# Altium project IMU sheild.PrjPcb
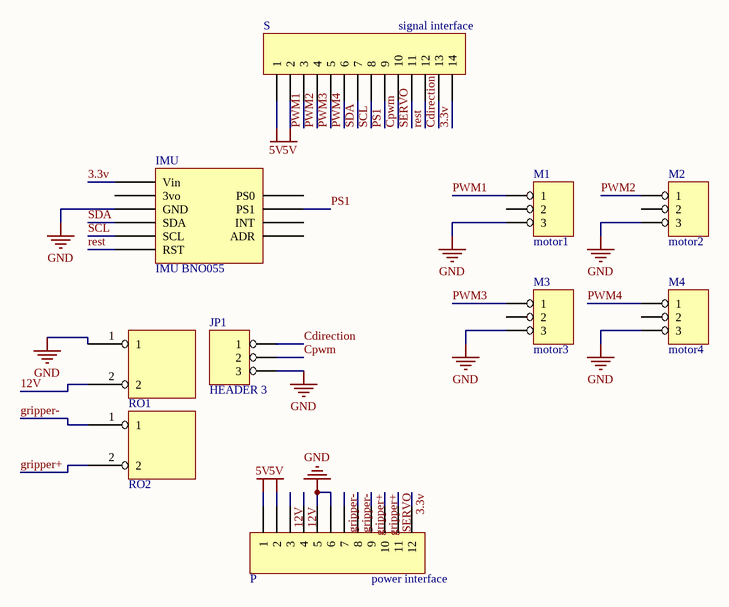
[diagram p0: IMU sheild.SchDoc]
1 sheet, 10 parts. Net scope: global (net labels, ports and power ports of the same name join across sheets).
Board file: IMU sheild.PcbDoc

## Sheet IMU sheild.SchDoc
size OrCAD A

### Parts
IMU  IMU BNO055  [bno055]
JP1  HEADER 3  [SIP3]
M1  motor1  [SIP3]
M2  motor2  [SIP3]
M3  motor3  [SIP3]
M4  motor4  [SIP3]
P  power interface  [HDR1X12]
RO1  Rossetta  [Rossetta 2-pin]  (value not drawn)
RO2  Rossetta  [Rossetta 2-pin]  (value not drawn)
S  signal interface  [HDR1X14]

### Nets
5V: P.1 P.2 S.1 S.2
GND: IMU.GND JP1.3 M1.3 M2.3 M3.3 M4.3 P.5 P.6 RO1.1
3.3v: IMU.Vin P.12 S.14
12V: P.3 P.4 RO1.2
Cdirection: JP1.1 S.13
Cpwm: JP1.2 S.10
gripper+: P.9 P.10 RO2.2
gripper-: P.7 P.8 RO2.1
PS1: IMU.ps1(PS1) S.9
PWM1: M1.1 S.3
PWM2: M2.1 S.4
PWM3: M3.1 S.5
PWM4: M4.1 S.6
rest: IMU.RST S.12
SCL: IMU.SCL S.8
SDA: IMU.SDA S.7
SERVO: P.11 S.11

Not connected (* = marked no-connect by the designer): IMU 3vo ADR INT PS0; M1 2; M2 2; M3 2; M4 2

### Library data of the parts
M1-M4 = HEADER 3
P = Header 12: Header, 12-Pin; LatestRevisionDate: 17-Jul-2002; LatestRevisionNote: Re-released for DXP Platform.; Publisher: Altium Limited
S = Header 14: Header, 14-Pin; LatestRevisionDate: 17-Jul-2002; LatestRevisionNote: Re-released for DXP Platform.; Publisher: Altium Limited